# EAGLE design woochi (EAGLE 6.2)
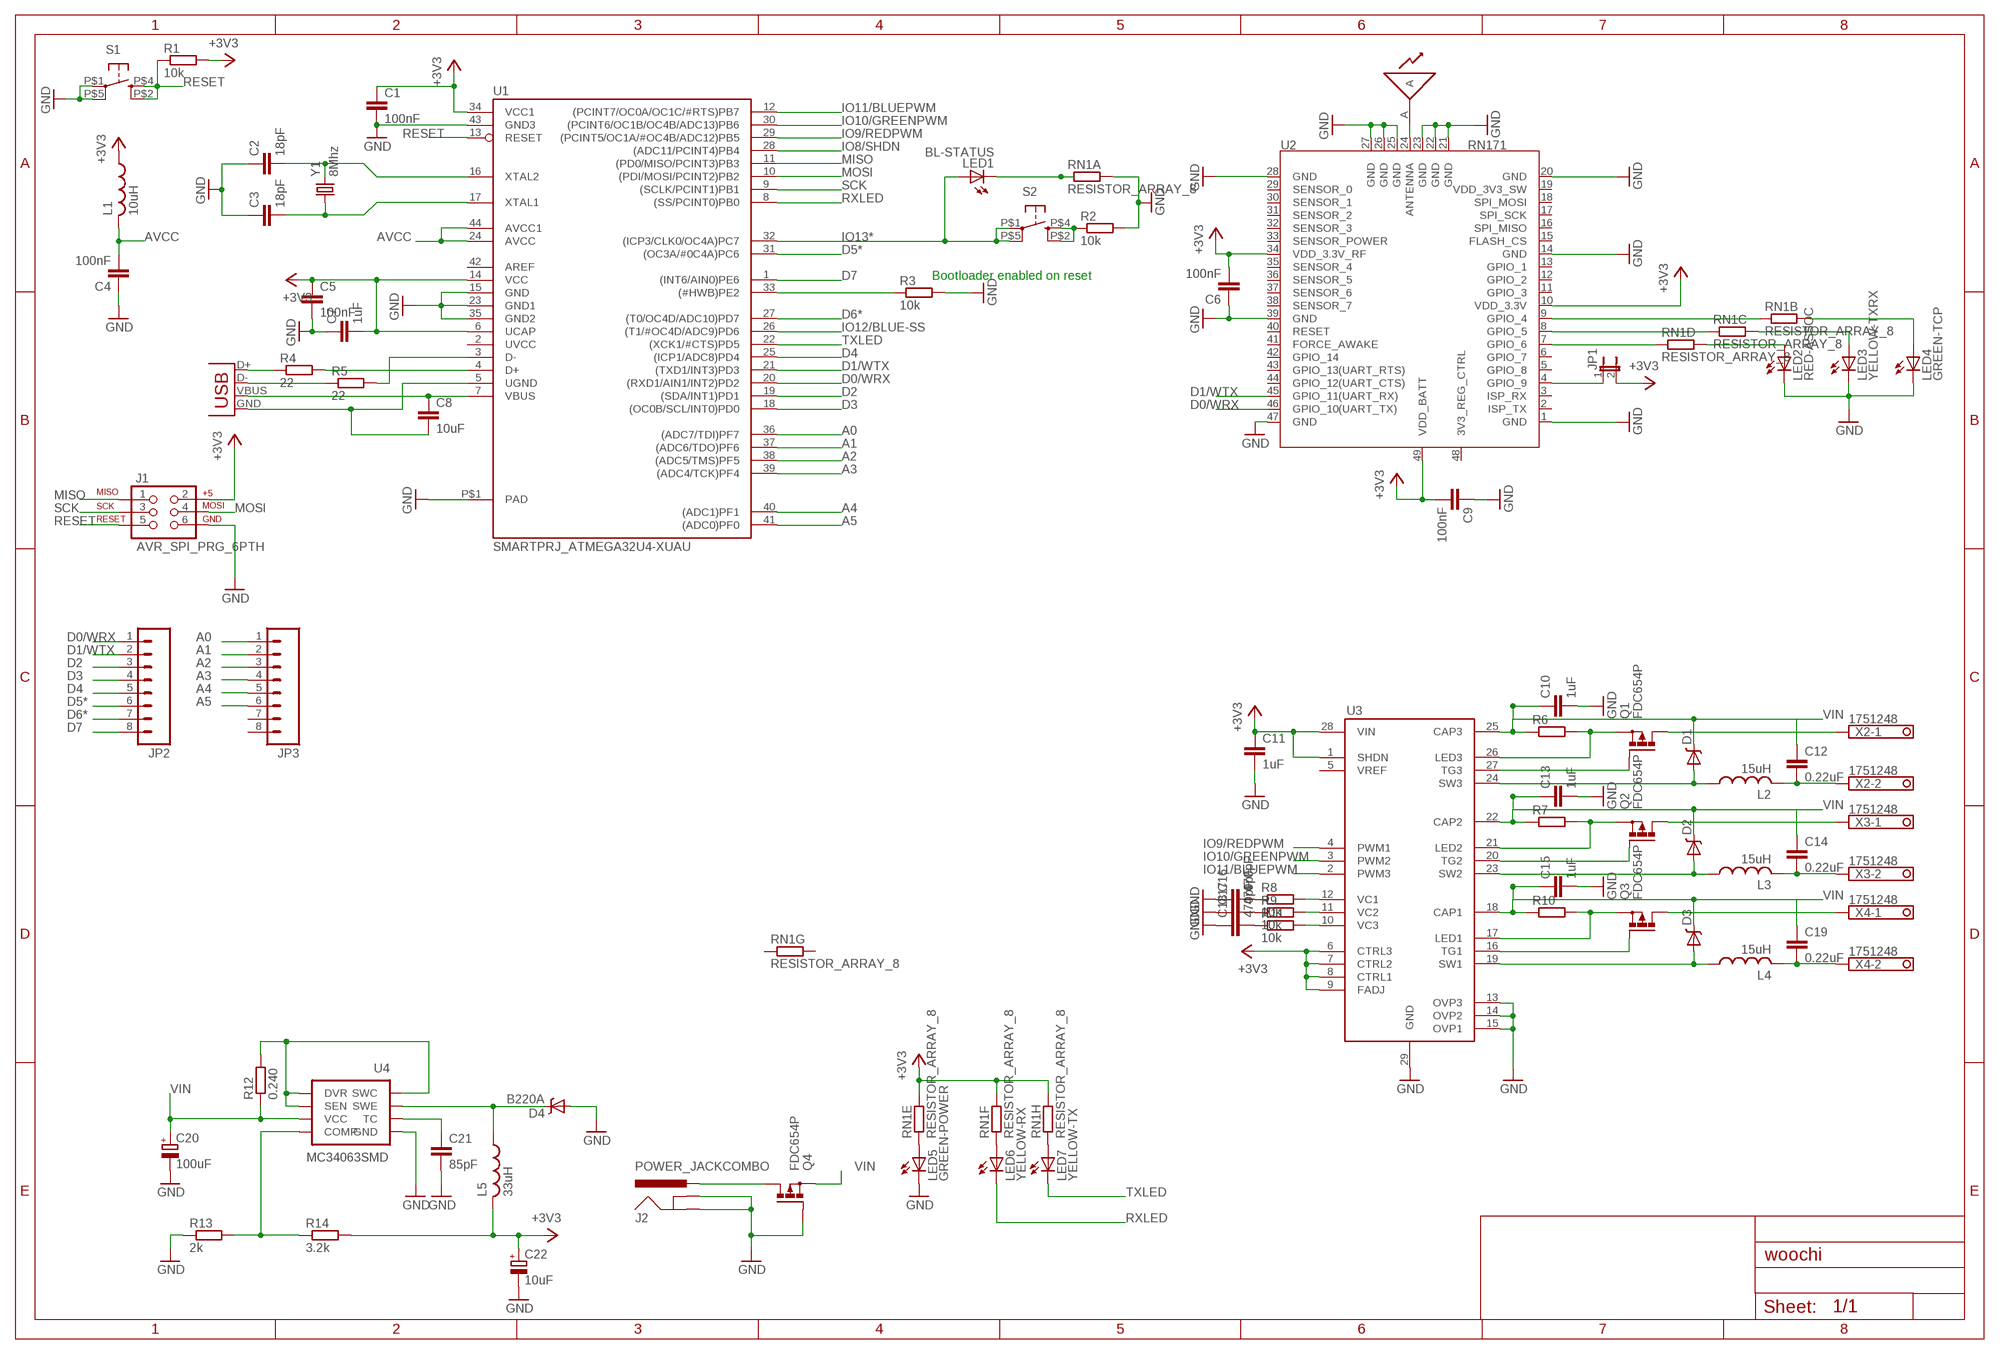
[diagram p0: schematic, sheet 1]

## Parts
A1  ANTENNAWIRE  [ANTENNA-WIRE]
C1  100nF  C-EUC0603  [C0603]
C2  18pF  C-EUC0603  [C0603]
C3  18pF  C-EUC0603  [C0603]
C4  100nF  C-EUC0603  [C0603]
C5  100nF  C-EUC0603  [C0603]
C6  100nF  C-EUC0603  [C0603]
C7  1uF  C-EUC0603  [C0603]
C8  10uF  C-EUC0603  [C0603]
C9  100nF  C-EUC0603  [C0603]
C10  1uF  C-EUC0603  [C0603]
C11  1uF  C-EUC0603  [C0603]
C12  0.22uF  C-EUC0603  [C0603]
C13  1uF  C-EUC0603  [C0603]
C14  0.22uF  C-EUC0603  [C0603]
C15  1uF  C-EUC0603  [C0603]
C16  470pF  C-EUC0603  [C0603]
C17  470pF  C-EUC0603  [C0603]
C18  470pF  C-EUC0603  [C0603]
C19  0.22uF  C-EUC0603  [C0603]
C20  100uF  CPOL-EUD  [PANASONIC_D]
C21  85pF  C-EUC0603  [C0603]
C22  10uF  CPOL-EUC  [PANASONIC_C]
D1  DIODE-SCHOTTKYBIGPAD  [SMA-DIODE-BIG]
D2  DIODE-SCHOTTKYBIGPAD  [SMA-DIODE-BIG]
D3  DIODE-SCHOTTKYBIGPAD  [SMA-DIODE-BIG]
D4  B220A  DIODE-SCHOTTKYBIGPAD  [SMA-DIODE-BIG]
J1  AVR_SPI_PRG_6PTH  [2X3]
J2  POWER_JACKCOMBO  [POWER_JACK_COMBO]
JP1  JUMPER-2PTH  [1X02]
JP2  M081X08  [1X08]
JP3  M081X08  [1X08]
L1  10uH  L-USL0603  [L0603]
L2  15uH  L-USBOURNS-6045  [BOURNS-6045]
L3  15uH  L-USBOURNS-6045  [BOURNS-6045]
L4  15uH  L-USBOURNS-6045  [BOURNS-6045]
L5  33uH  L-USBOURNS-6045  [BOURNS-6045]
LED1  BL-STATUS  LEDSML0603  [SML0603]
LED2  RED-ASSOC  LEDSML0603  [SML0603]
LED3  YELLOW-TXRX  LEDSML0603  [SML0603]
LED4  GREEN-TCP  LEDSML0603  [SML0603]
LED5  GREEN-POWER  LEDSML0603  [SML0603]
LED6  YELLOW-RX  LEDSML0603  [SML0603]
LED7  YELLOW-TX  LEDSML0603  [SML0603]
Q1  FDC654P  [SUPERSOT6]
Q2  FDC654P  [SUPERSOT6]
Q3  FDC654P  [SUPERSOT6]
Q4  FDC654P  [SUPERSOT6]
R1  10k  R-EU_R0603  [R0603]
R2  10k  R-EU_R0603  [R0603]
R3  10k  R-EU_R0603  [R0603]
R4  22  R-EU_R0603  [R0603]
R5  22  R-EU_R0603  [R0603]
R6  R-EU_R0603  [R0603]
R7  R-EU_R0603  [R0603]
R8  10k  R-EU_R0603  [R0603]
R9  10k  R-EU_R0603  [R0603]
R10  R-EU_R0603  [R0603]
R11  10k  R-EU_R0603  [R0603]
R12  0.240  R-EU_R0603  [R0603]
R13  2k  R-EU_R0603  [R0603]
R14  3.2k  R-EU_R0603  [R0603]
RN1  RESISTOR_ARRAY_8  [CAT16-F8/CAT16-J8]
S1  TAC_SWITCH  [CK-KMS_PEGS]
S2  TAC_SWITCH  [CK-KMS_PEGS]
U1  SMARTPRJ_ATMEGA32U4-XUAU  [SMARTPRJ_TQFP44-PAD]
U2  RN171  MODULE_WIFI-RN-171  [MODULE_49P-1.27-26.67X17.78]
U3  LT3496  [SSOP28_THERMAL]
U4  MC34063SMD  [SO08]
X1  USB-MICROB  [USB-MICROB]
X2  1751248  [1751248]
X3  1751248  [1751248]
X4  1751248  [1751248]
Y1  8Mhz  CRYSTALSMD  [HC49UP]

## Nets
+3V3: C1.1 C5.1 C6.2 C7.2 C9.2 C11.1 C22.+ J1.2 JP1.2 L1.1 L5.P$2 R1.2 R14.2 RN1.9 RN1.11 RN1.12 U1.6(UCAP) U1.14(VCC) U1.34(VCC1) U2.10(VDD_3.3V) U2.34(VDD_3.3V_RF) U2.49(VDD_BATT) U3.1(SHDN) U3.6(CTRL3) U3.7(CTRL2) U3.8(CTRL1) U3.9(FADJ) U3.28(VIN)
A0: JP3.1 U1.36((ADC7/TDI)PF7)
A1: JP3.2 U1.37((ADC6/TDO)PF6)
A2: JP3.3 U1.38((ADC5/TMS)PF5)
A3: JP3.4 U1.39((ADC4/TCK)PF4)
A4: JP3.5 U1.40((ADC1)PF1)
A5: JP3.6 U1.41((ADC0)PF0)
AVCC: C4.2 L1.2 U1.24(AVCC) U1.44(AVCC1)
D0/WRX: JP2.1 U1.20((RXD1/AIN1/INT2)PD2) U2.46(GPIO_10(UART_TX))
D1/WTX: JP2.2 U1.21((TXD1/INT3)PD3) U2.45(GPIO_11(UART_RX))
D2: JP2.3 U1.19((SDA/INT1)PD1)
D3: JP2.4 U1.18((OC0B/SCL/INT0)PD0)
D4: JP2.5 U1.25((ICP1/ADC8)PD4)
D5*: JP2.6 U1.31((OC3A/#0C4A)PC6)
D6*: JP2.7 U1.27((T0/OC4D/ADC10)PD7)
D7: JP2.8 U1.1((INT6/AIN0)PE6)
GND: C1.2 C2.1 C3.1 C4.1 C5.2 C6.1 C7.1 C9.1 C10.2 C11.2 C13.2 C15.2 C16.1 C17.1 C18.1 C20.- C21.2 C22.- D4.A J1.6 J2.GND(GNDBREAK) J2.GND@1(GND) LED2.C LED3.C LED4.C LED5.C Q4.P$3(G) R2.2 R3.2 R13.1 RN1.16 S1.P$1 S1.P$5 U1.15(GND) U1.23(GND1) U1.35(GND2) U1.43(GND3) U1.P$1(PAD) U2.1(GND) U2.14(GND) U2.20(GND) U2.21(GND) U2.22(GND) U2.23(GND) U2.25(GND) U2.26(GND) U2.27(GND) U2.28(GND) U2.39(GND) U2.47(GND) U3.13(OVP3) U3.14(OVP2) U3.15(OVP1) U3.29(GND) U4.4(GND)
IO8/SHDN: U1.28((ADC11/PCINT4)PB4)
IO9/REDPWM: U1.29((PCINT5/OC1A/#OC4B/ADC12)PB5) U3.4(PWM1)
IO10/GREENPWM: U1.30((PCINT6/OC1B/OC4B/ADC13)PB6) U3.3(PWM2)
IO11/BLUEPWM: U1.12((PCINT7/OC0A/OC1C/#RTS)PB7) U3.2(PWM3)
IO12/BLUE-SS: U1.26((T1/#OC4D/ADC9)PD6)
IO13*: LED1.A S2.P$1 S2.P$5 U1.32((ICP3/CLK0/OC4A)PC7)
MISO: J1.1 U1.11((PD0/MISO/PCINT3)PB3)
MOSI: J1.4 U1.10((PDI/MOSI/PCINT2)PB2)
N$1: LED5.A RN1.5
N$2: A1.A U2.24(ANTENNA)
N$3: RN1.2 U2.9(GPIO_4)
N$4: RN1.3 U2.8(GPIO_5)
N$5: RN1.4 U2.7(GPIO_6)
N$6: LED2.A RN1.13
N$7: LED3.A RN1.14
N$8: LED4.A RN1.15
N$9: C8.2 U1.5(UGND) X1.GND
N$10: R4.1 X1.D+
N$11: JP1.1 U2.4(GPIO_9)
N$12: R5.1 X1.D-
N$13: C8.1 U1.7(VBUS) X1.VBUS
N$14: R4.2 U1.4(D+)
N$15: R5.2 U1.3(D-)
N$16: LED1.C RN1.1
N$17: LED6.A RN1.6
N$18: LED7.A RN1.8
N$19: J1.5
N$20: R3.1 U1.33((#HWB)PE2)
N$21: R12.2 U4.1(SWC) U4.7(SEN) U4.8(DVR)
N$22: J2.POWER(PWR) Q4.P$1(D) Q4.P$2(D) Q4.P$5(D) Q4.P$6(D)
N$23: D4.C L5.P$1 U4.2(SWE)
N$24: R2.1 S2.P$2 S2.P$4
N$25: C21.1 U4.3(TC)
N$26: R13.2 R14.1 U4.5(COMP)
N$27: C12.2 L2.P$2 X2.2
N$28: Q1.P$4(S) R6.2 U3.26(LED3)
N$29: D1.A L2.P$1 U3.24(SW3)
N$30: Q2.P$4(S) R7.2 U3.21(LED2)
N$31: Q1.P$1(D) Q1.P$2(D) Q1.P$5(D) Q1.P$6(D) X2.1
N$32: Q1.P$3(G) U3.27(TG3)
N$33: C14.2 L3.P$2 X3.2
N$34: R11.2 U3.10(VC3)
N$35: R9.2 U3.11(VC2)
N$36: R8.2 U3.12(VC1)
N$37: C16.2 R8.1
N$38: C17.2 R9.1
N$39: C18.2 R11.1
N$40: D2.A L3.P$1 U3.23(SW2)
N$41: Q2.P$3(G) U3.20(TG2)
N$42: Q2.P$1(D) Q2.P$2(D) Q2.P$5(D) Q2.P$6(D) X3.1
N$43: Q3.P$4(S) R10.2 U3.17(LED1)
N$44: C19.2 L4.P$2 X4.2
N$45: D3.A L4.P$1 U3.19(SW1)
N$46: Q3.P$3(G) U3.16(TG1)
N$47: Q3.P$1(D) Q3.P$2(D) Q3.P$5(D) Q3.P$6(D) X4.1
RESET: R1.1 S1.P$2 S1.P$4 U1.13(RESET)
RXLED: LED6.C U1.8((SS/PCINT0)PB0)
SCK: J1.3 U1.9((SCLK/PCINT1)PB1)
TXLED: LED7.C U1.22((XCK1/#CTS)PD5)
VIN: C10.1 C12.1 C13.1 C14.1 C15.1 C19.1 C20.+ D1.C D2.C D3.C Q4.P$4(S) R6.1 R7.1 R10.1 R12.1 U3.18(CAP1) U3.22(CAP2) U3.25(CAP3) U4.6(VCC)
XTAL1: C3.2 U1.17(XTAL1) Y1.1
XTAL2: C2.2 U1.16(XTAL2) Y1.2
Unconnected: JP3.7 JP3.8 RN1.7 RN1.10 U2.2(ISP_TX) U2.3(ISP_RX) U2.5(GPIO_8) U2.6(GPIO_7) U2.11(GPIO_3) U2.12(GPIO_2) U2.13(GPIO_1) U2.15(FLASH_CS) U2.16(SPI_MISO) U2.17(SPI_SCK) U2.18(SPI_MOSI) U2.19(VDD_3V3_SW) U2.29(SENSOR_0) U2.30(SENSOR_1) U2.31(SENSOR_2) U2.32(SENSOR_3) U2.33(SENSOR_POWER) U2.35(SENSOR_4) U2.36(SENSOR_5) U2.37(SENSOR_6) U2.38(SENSOR_7) U2.40(RESET) U2.41(FORCE_AWAKE) U2.42(GPIO_14) U2.43(GPIO_13(UART_RTS)) U2.44(GPIO_12(UART_CTS)) U2.48(3V3_REG_CTRL) U3.5(VREF)

## Notes on the sheet
- Bootloader enabled on reset

## Power pins joined to a net without a drawn wire
AREF: U1.42(AREF)
UVCC: U1.2(UVCC)

## Library data of the parts
A1 = antenna:ANTENNA
C1-C19 C21 = rcl:C-EU: CAPACITOR, European symbol
C20 C22 = rcl:CPOL-EU: POLARIZED CAPACITOR, European symbol
D1-D4 = diode-schottky:DIODE-SCHOTTKY
J1 = SparkFun:AVR_SPI_PRG_6: AVR ISP 6 Pin This is the reduced ISP connector for AVR programming. Common on Arduino. This footprint will take up less PCB space and can be used with a 10-pin to 6-pin adapter such as SKU: BOB-08508
J2 = power-connectors:POWER_JACK: Power Jack This is the standard 5.5mm barrel jack for power. The PTH is the most common, proven, reliable, footprint. All others are experimental. The Slot footprint only works if the mill layer is transmitted to the PCB fab house so be warned. Spark Fun Electronics SKU : PRT-00119. Mating wall wart : TOL-00298 (and others)
JP1 = SparkFun:JUMPER-2: Jumper Basic 0.1" spaced jumper. Use with breakaway headers.
JP2 JP3 = SparkFun:M08: Header 8 Standard 8-pin 0.1" header. Use with straight break away headers (SKU : PRT-00116), right angle break away headers (PRT-00553), swiss pins (PRT-00743), machine pins (PRT-00117), and female headers (PRT-00115).
L1-L5 = inductors:L-US: INDUCTOR, American symbol
LED1-LED7 = led:LED: LED OSRAM: - CHIPLED LG R971, LG N971, LY N971, LG Q971, LY Q971, LO R971, LY R971 LH N974, LH R974 LS Q976, LO Q976, LY Q976 LO Q996 - Hyper CHIPLED LW Q18S LB Q993, LB Q99A, LB R99A - SideLED LS A670, LO A670, LY A670, LG A670, LP A670 LB A673, LV A673, LT A673, LW A673 LH A674 LY A675 LS A676, LA A676, LO A676, LY A676, LW A676 LS A679, LY A679, LG A679 - Hyper Micro SIDELED® LS Y876, LA Y876, LO Y876, LY Y876 LT Y87S - SmartLED LW L88C, LW L88S LB L89C, LB L89S, LG L890 LS L89K, LO L89K, LY L89K LS L896, LA L896, LO L896, LY L896 - TOPLED LS T670, LO T670, LY T670, LG T670, LP T670 LSG T670, LSP T670, LSY T670, LOP T670, LYG T670 LG T671, LOG T671, LSG T671 LB T673, LV T673, LT T673, LW T673 LH T674 LS T676, LA T676, LO T676, LY T676, LB T676, LH T676, LSB T676, LW T676 LB T67C, LV T67C, LT T67C, LS T67K, LO T67K, LY T67K, LW E67C LS E67B, LA E67B, LO E67B, LY E67B, LB E67C, LV E67C, LT E67C LW T67C LS T679, LY T679, LG T679 LS T770, LO T770, LY T770, LG T770, LP T770 LB T773, LV T773, LT T773, LW T773 LH T774 LS E675, LA E675, LY E675, LS T675 LS T776, LA T776, LO T776, LY T776, LB T776 LHGB T686 LT T68C, LB T68C - Hyper Mini TOPLED® LB M676 - Mini TOPLED Santana® LG M470 LS M47K, LO M47K, LY M47K Source: http://www.osram.convergy.de LUXEON: - LUMILED® LXK2-PW12-R00, LXK2-PW12-S00, LXK2-PW14-U00, LXK2-PW14-V00 LXK2-PM12-R00, LXK2-PM12-S00, LXK2-PM14-U00 LXK2-PE12-Q00, LXK2-PE12-R00, LXK2-PE12-S00, LXK2-PE14-T00, LXK2-PE14-U00 LXK2-PB12-K00, LXK2-PB12-L00, LXK2-PB12-M00, LXK2-PB14-N00, LXK2-PB14-P00, LXK2-PB14-Q00 LXK2-PR12-L00, LXK2-PR12-M00, LXK2-PR14-Q00, LXK2-PR14-R00 LXK2-PD12-Q00, LXK2-PD12-R00, LXK2-PD12-S00 LXK2-PH12-R00, LXK2-PH12-S00 LXK2-PL12-P00, LXK2-PL12-Q00, LXK2-PL12-R00 Source: www.luxeon.com KINGBRIGHT: KA-3528ASYC Source: www.kingbright.com
Q1-Q4 = mosfet:FDC654P: FDC654P
R1 R4-R14 = rcl:R-EU_: RESISTOR, European symbol
R2 R3 = resistor:R-EU_: RESISTOR, European symbol
RN1 = dp_devices:RESISTOR_ARRAY_8
S1 S2 = buttons:TAC_SWITCH: Momentary Switch Button commonly used for reset or general input. Spark Fun Electronics SKU : COM-00097
U1 = atmega32u4:SMARTPRJ_ATMEGA32U4-XU
U2 = seeedstudio-rn171:MODULE_WIFI-RN-171: WIFLY GSX 802.11 b/g wireless LAN Module
U3 = lt3496:LT3496: LT3496 3ch 45V/700mA LED Driver
U4 = SparkFun:MC34063
X1 = SparkFun:USB: USB Connectors USB-B-PTH is fully proven SKU : PRT-00139 USB-miniB is fully proven SKU : PRT-00587 USB-A-PCB is untested. USB-A-H is throughly reviewed, but untested. Spark Fun Electronics SKU : PRT-00437 USB-B-SMT is throughly reviewed, but untested. Needs silkscreen touching up. USB-A-S has not been used/tested USB-MB-H has not been used/tested
X2-X4 = con-phoenix-350:1751248: MKDS 1/ 2-3,5 Printklemme Nennstrom: 10 A Bemessungsspannung: 160 V Raster: 3,5 mm Polzahl: 2 Montageart: Löten Anschlussart: Schraubanschluss Anschlussrichtung vom Leiter zur Platine: 0° Source: http://eshop.phoenixcontact.com .. 1751248.pdf; OC_FARNELL: unknown; OC_NEWARK: unknown
Y1 = SparkFun:CRYSTAL: Crystals Various standard crystals. Proven footprints. Spark Fun Electronics SKU : COM-00534

## Board
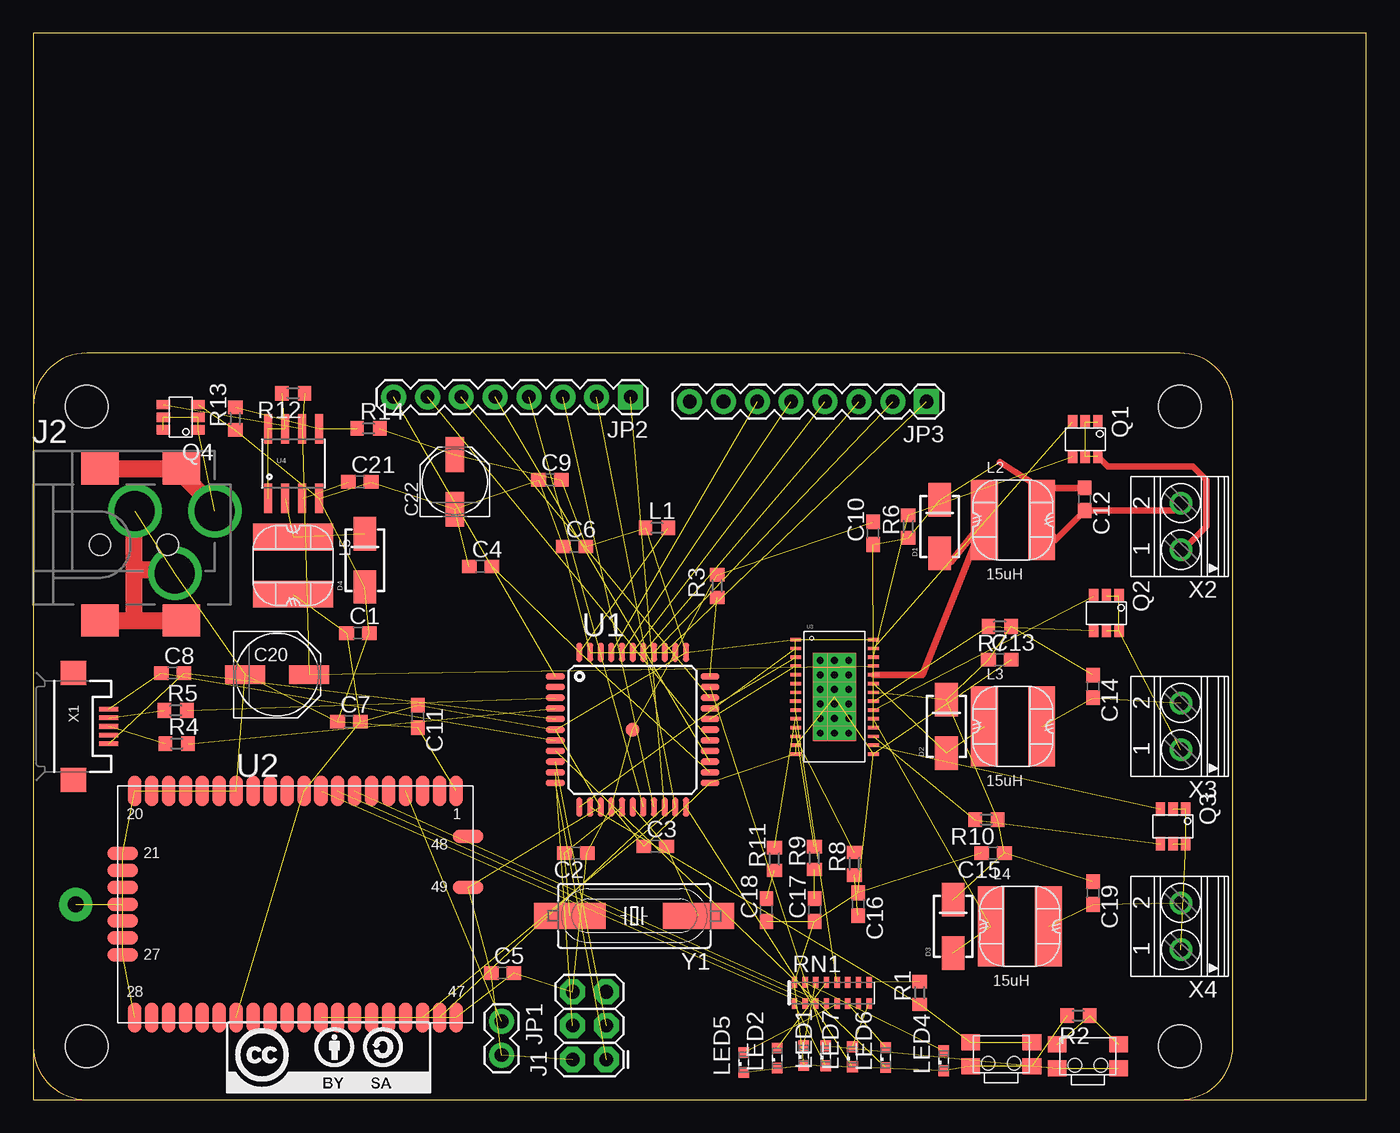
[diagram p1: board, top side]

Size 100 x 80 mm. Coordinates in mm from the lower left corner, seen from the top.
Outline: 0,0 100,0 100,80 0,80 0,0
Copper layers (1*16): Top 0.035mm / dielectric 1.5mm / Bottom 0.035mm
Design rules: minimum track width 10mil, minimum drill 24mil, track to track 8mil, track to pad 8mil, pad to pad 8mil, via to via 8mil, smd to smd 8mil, copper to edge 40mil, drill to drill 8mil, minimum pad ring 10mil, minimum via ring 8mil, stop-mask expansion 4mil, vias tented up to drill 0mil, thermal gap 10mil

### Footprints (pad centres in the part's own frame; a part is rotated, then mirrored left to right if it is on the bottom)
ANTENNA-WIRE = drill 1.2 pad 2.5: A 0,0
C0603 = smd 1.1 x 1: 1 -0.85,0; 2 0.85,0
PANASONIC_D = smd 3 x 1.4: + 2.4,0; - -2.4,0
PANASONIC_C = smd 2.6 x 1.4: + 2.05,0; - -2.05,0
SMA-DIODE-BIG = smd 2.5 x 1.7: A -2,0; C 2,0
2X3 = drill 1.016 pad 1.88 octagon: 1 0,0; 2 0,2.54; 3 2.54,0; 4 2.54,2.54; 5 5.08,0; 6 5.08,2.54
POWER_JACK_COMBO = drill 2.997: GND 5.62,-2.16; GND@1 2.62,2.54; POWER 8.62,2.54 | smd 2.8 x 2.4: GND@3 0,-5.7; GND@4 6.1,-5.7; POWER@1 0,5.7; POWER@2 6.1,5.7 | hole 1.6: 0,0; 5.08,0
1X02 = drill 1.016 pad 1.88: 1 0,0; 2 2.54,0
1X08 = drill 1.016 pad 1.88 square: 1 0,0 | drill 1.016 pad 1.88: 2 2.54,0; 3 5.08,0; 4 7.62,0; 5 10.16,0; 6 12.7,0; 7 15.24,0; 8 17.78,0
L0603 = smd 1 x 1.1: 1 -0.85,0; 2 0.85,0
BOURNS-6045 = smd 2 x 6: P$1 -2.15,0; P$2 2.15,0
SML0603 = smd 0.8 x 0.8: A 0.75,0; C -0.75,0
SUPERSOT6 = smd 0.7 x 1: P$1 -0.95,-1.3; P$2 0,-1.3; P$3 0.95,-1.3; P$4 0.95,1.3; P$5 0,1.3; P$6 -0.95,1.3
R0603 = smd 1 x 1.1: 1 -0.85,0; 2 0.85,0
CAT16-F8/CAT16-J8 = smd 0.4 x 0.8: 1 -2.4,-0.8; 2 -1.6,-0.8; 3 -0.8,-0.8; 4 0,-0.8; 5 0.8,-0.8; 6 1.6,-0.8; 7 2.4,-0.8; 8 3.2,-0.8; 9 3.2,0.8; 10 2.4,0.8; 11 1.6,0.8; 12 0.8,0.8; 13 0,0.8; 14 -0.8,0.8; 15 -1.6,0.8; 16 -2.4,0.8
CK-KMS_PEGS = smd 1.2 x 1.4: P$1 -0.9,2.3; P$2 0.9,2.3; P$4 0.9,-2.3; P$5 -0.9,-2.3 | hole 1: -0.675,0.975; -0.675,-0.975
SMARTPRJ_TQFP44-PAD = smd 1.4 x 0.45: 1 -5.8,4; 2 -5.8,3.2; 3 -5.8,2.4; 4 -5.8,1.6; 5 -5.8,0.8; 6 -5.8,0; 7 -5.8,-0.8; 8 -5.8,-1.6; 9 -5.8,-2.4; 10 -5.8,-3.2; 11 -5.8,-4; 23 5.8,-4; 24 5.8,-3.2; 25 5.8,-2.4; 26 5.8,-1.6; 27 5.8,-0.8; 28 5.8,0; 29 5.8,0.8; 30 5.8,1.6; 31 5.8,2.4; 32 5.8,3.2; 33 5.8,4 | smd 0.45 x 1.4: 12 -4,-5.8; 13 -3.2,-5.8; 14 -2.4,-5.8; 15 -1.6,-5.8; 16 -0.8,-5.8; 17 0,-5.8; 18 0.8,-5.8; 19 1.6,-5.8; 20 2.4,-5.8; 21 3.2,-5.8; 22 4,-5.8; 34 4,5.8; 35 3.2,5.8; 36 2.4,5.8; 37 1.6,5.8; 38 0.8,5.8; 39 0,5.8; 40 -0.8,5.8; 41 -1.6,5.8; 42 -2.4,5.8; 43 -3.2,5.8; 44 -4,5.8 | smd 1 x 1: P$1 0,0
MODULE_49P-1.27-26.67X17.78 = smd 1.016 x 2.286: 1 12.065,8.509; 2 10.795,8.509; 3 9.525,8.509; 4 8.255,8.509; 5 6.985,8.509; 6 5.715,8.509; 7 4.445,8.509; 8 3.175,8.509; 9 1.905,8.509; 10 0.635,8.509; 11 -0.635,8.509; 12 -1.905,8.509; 13 -3.175,8.509; 14 -4.445,8.509; 15 -5.715,8.509; 16 -6.985,8.509; 17 -8.255,8.509; 18 -9.525,8.509; 19 -10.795,8.509; 20 -12.065,8.509; 28 -12.065,-8.509; 29 -10.795,-8.509; 30 -9.525,-8.509; 31 -8.255,-8.509; 32 -6.985,-8.509; 33 -5.715,-8.509; 34 -4.445,-8.509; 35 -3.175,-8.509; 36 -1.905,-8.509; 37 -0.635,-8.509; 38 0.635,-8.509; 39 1.905,-8.509; 40 3.175,-8.509; 41 4.445,-8.509; 42 5.715,-8.509; 43 6.985,-8.509; 44 8.255,-8.509; 45 9.525,-8.509; 46 10.795,-8.509; 47 12.065,-8.509 | smd 2.286 x 1.016: 21 -12.954,3.81; 22 -12.954,2.54; 23 -12.954,1.27; 24 -12.954,0; 25 -12.954,-1.27; 26 -12.954,-2.54; 27 -12.954,-3.81; 48 12.954,5.08; 49 12.954,1.27
SSOP28_THERMAL = smd 0.8 x 0.25: 1 -2.921,4.298; 2 -2.921,3.637; 3 -2.921,2.977; 4 -2.921,2.317; 5 -2.921,1.656; 6 -2.921,0.996; 7 -2.921,0.335; 8 -2.927,-0.325; 9 -2.921,-0.985; 10 -2.921,-1.646; 11 -2.921,-2.306; 12 -2.921,-2.967; 13 -2.921,-3.627; 14 -2.921,-4.287; 15 2.921,-4.287; 16 2.921,-3.627; 17 2.921,-2.967; 18 2.921,-2.306; 19 2.921,-1.646; 20 2.921,-0.985; 21 2.927,-0.325; 22 2.921,0.335; 23 2.921,0.996; 24 2.921,1.656; 25 2.921,2.317; 26 2.921,2.977; 27 2.921,3.637; 28 2.921,4.298 | smd 3.2 x 6.6: 29 0,0.005 | drill 0.508 square: P$1 -1.067,2.743; P$2 0,2.743; P$3 1.067,2.743; P$4 -1.067,1.651; P$5 0,1.651; P$6 1.067,1.651; P$7 -1.067,0.559; P$8 0,0.559; P$9 1.067,0.559; P$10 -1.067,-0.533; P$11 0,-0.533; P$12 1.067,-0.533; P$13 -1.067,-1.626; P$14 0,-1.626; P$15 1.067,-1.626; P$16 -1.067,-2.718; P$17 0,-2.718; P$18 1.067,-2.718
SO08 = smd 0.61 x 2.21: 1 -1.905,-2.616; 2 -0.635,-2.616; 3 0.635,-2.616; 4 1.905,-2.616; 5 1.905,2.616; 6 0.635,2.616; 7 -0.635,2.616; 8 -1.905,2.616
DP9056_V1 = hole 3.2: 4,4; 86,4; 86,52; 4,52
USB-MICROB = smd 0.35 x 1.4: D+ 0,2.65; D- -0.65,2.65; GND 1.3,2.65; ID 0.65,2.65; VBUS -1.3,2.65 | smd 1.8 x 1.9: MT1 -4,0; MT2 4,0
1751248 = drill 1.1 pad 1.7: 1 -1.75,-0.1; 2 1.75,-0.1
HC49UP = smd 5.334 x 1.93: 1 -4.826,0; 2 4.826,0

### Placement (x,y rotation side)
A1  3.18,14.63 0 top
C1  24.35,35 0 top
C2  40.7,18.5 180 top
C3  46.65,19 0 top
C4  33.55,40 0 top
C5  35.2,9.5 0 top
C6  40.6,41.5 0 top
C7  23.68,28.35 0 top
C8  10.45,32 0 top
C9  38.75,46.5 0 top
C10  63,42.5 90 top
C11  28.85,28.74 270 top
C12  78.88,45.04 270 top
C13  72.5,33 0 top
C14  79.5,31 270 top
C15  72,18.5 180 top
C16  61.88,14.66 270 top
C17  58.62,14.22 90 top
C18  55,14.22 90 top
C19  79.5,15.5 270 top
C20  18.29,31.88 0 top
C21  24.49,46.35 0 top
C22  31.62,46.35 90 top
D1  68,43 90 top
D2  68.5,28 90 top
D3  69,13 90 top
D4  24.87,40.46 90 top
J1  43,3 90 top
J2  5,41.63 0 top
JP1  35.13,5.87 270 top
JP2  44.81,52.72 180 top
JP3  67.02,52.37 180 top
L1  46.78,42.9 0 top
L2  73.5,43.5 0 top
L3  73.5,28 0 top
L4  74,13 0 top
L5  19.49,40.06 270 top
LED1  59.45,3.28 90 top
LED2  55.8,3.11 90 top
LED3  57.8,3.31 90 top
LED4  68.3,2.91 90 top
LED5  53.3,2.78 90 top
LED6  63.95,3.14 90 top
LED7  61.45,3.21 90 top
Q1  78.92,49.55 180 top
Q2  80.5,36.5 180 top
Q3  85.5,20.5 180 top
Q4  11.05,51.2 90 top
R1  66.5,8 90 top
R2  78.4,6.3 180 top
R3  51.3,38.52 90 top
R4  10.76,26.7 0 top
R5  10.68,29.2 0 top
R6  65.64,42.99 90 top
R7  72.5,35.5 180 top
R8  61.6,17.7 90 top
R9  58.6,18.12 90 top
R10  71.5,21 180 top
R11  55.6,18.04 90 top
R12  19.5,53 180 top
R13  15.15,51.09 90 top
R14  25.14,50.35 0 top
RN1  59.5,8 0 top
S1  72.62,3.4 90 top
S2  79.12,3.24 90 top
U1  44.97,27.75 0 top
U2  19.67,14.66 0 top
U3  60.11,30.21 0 top
U4  19.53,47.72 0 top
U$1  [DP9056_V1]  0,0 0 top
U$2  [LOGO_CC-BY-SA]  14.5,0.5 0 top
X1  3,28 270 top
X2  86,43 90 top
X3  86,28 90 top
X4  86,13 90 top
Y1  45.08,13.78 180 top

### Tracks (layer width: path | path; a pad name or v marks a point on that pad's centre or on a via)
+3V3  (27 unrouted)
A0  (1 unrouted)
A1  (1 unrouted)
A2  (1 unrouted)
A3  (1 unrouted)
A4  (1 unrouted)
A5  (1 unrouted)
AVCC  (3 unrouted)
D0/WRX  (2 unrouted)
D1/WTX  (2 unrouted)
D2  (1 unrouted)
D3  (1 unrouted)
D4  (1 unrouted)
D5*  (1 unrouted)
D6*  (1 unrouted)
D7  (1 unrouted)
GND  (54 unrouted)
IO9/REDPWM  (1 unrouted)
IO10/GREENPWM  (1 unrouted)
IO11/BLUEPWM  (1 unrouted)
IO13*  (3 unrouted)
MISO  (1 unrouted)
MOSI  (1 unrouted)
N$1  (1 unrouted)
N$2  (1 unrouted)
N$3  (1 unrouted)
N$4  (1 unrouted)
N$5  (1 unrouted)
N$6  (1 unrouted)
N$7  (1 unrouted)
N$8  (1 unrouted)
N$9  (2 unrouted)
N$10  (1 unrouted)
N$11  (1 unrouted)
N$12  (1 unrouted)
N$13  (2 unrouted)
N$14  (1 unrouted)
N$15  (1 unrouted)
N$16  (1 unrouted)
N$17  (1 unrouted)
N$18  (1 unrouted)
N$20  (1 unrouted)
N$21  (3 unrouted)
N$22  (4 unrouted)
N$23  (2 unrouted)
N$24  (2 unrouted)
N$25  (1 unrouted)
N$26  (2 unrouted)
N$27
  Top 0.5: X2.2 85.54,44.19 C12.2 76.69,42 76.69,42.04 L2.P$2
N$28  (2 unrouted)
N$29
  Top 0.5: U3.24 66.72,31.87 L2.P$1 68.85,40.35 D1.A
N$30  (2 unrouted)
N$31  (3 unrouted)
  Top 0.5: X2.1 86.25,41.25 88,43 88,46.5 87,47.5 80.62,47.5 Q1.P$6
N$32  (1 unrouted)
N$33  (2 unrouted)
N$34  (1 unrouted)
N$35  (1 unrouted)
N$36  (1 unrouted)
N$37  (1 unrouted)
N$38  (1 unrouted)
N$39  (1 unrouted)
N$40  (2 unrouted)
N$41  (1 unrouted)
N$42  (4 unrouted)
N$43  (2 unrouted)
N$44  (2 unrouted)
N$45  (2 unrouted)
N$46  (1 unrouted)
N$47  (4 unrouted)
RESET  (3 unrouted)
RXLED  (1 unrouted)
SCK  (1 unrouted)
TXLED  (1 unrouted)
VIN  (18 unrouted)
  Top 0.5: 78.63,45.64 C12.1 75.54,45.89 72.5,47.85
XTAL1  (2 unrouted)
XTAL2  (2 unrouted)